# EAGLE schematic CD_CONTROL_BRD (EAGLE 7.2.0)
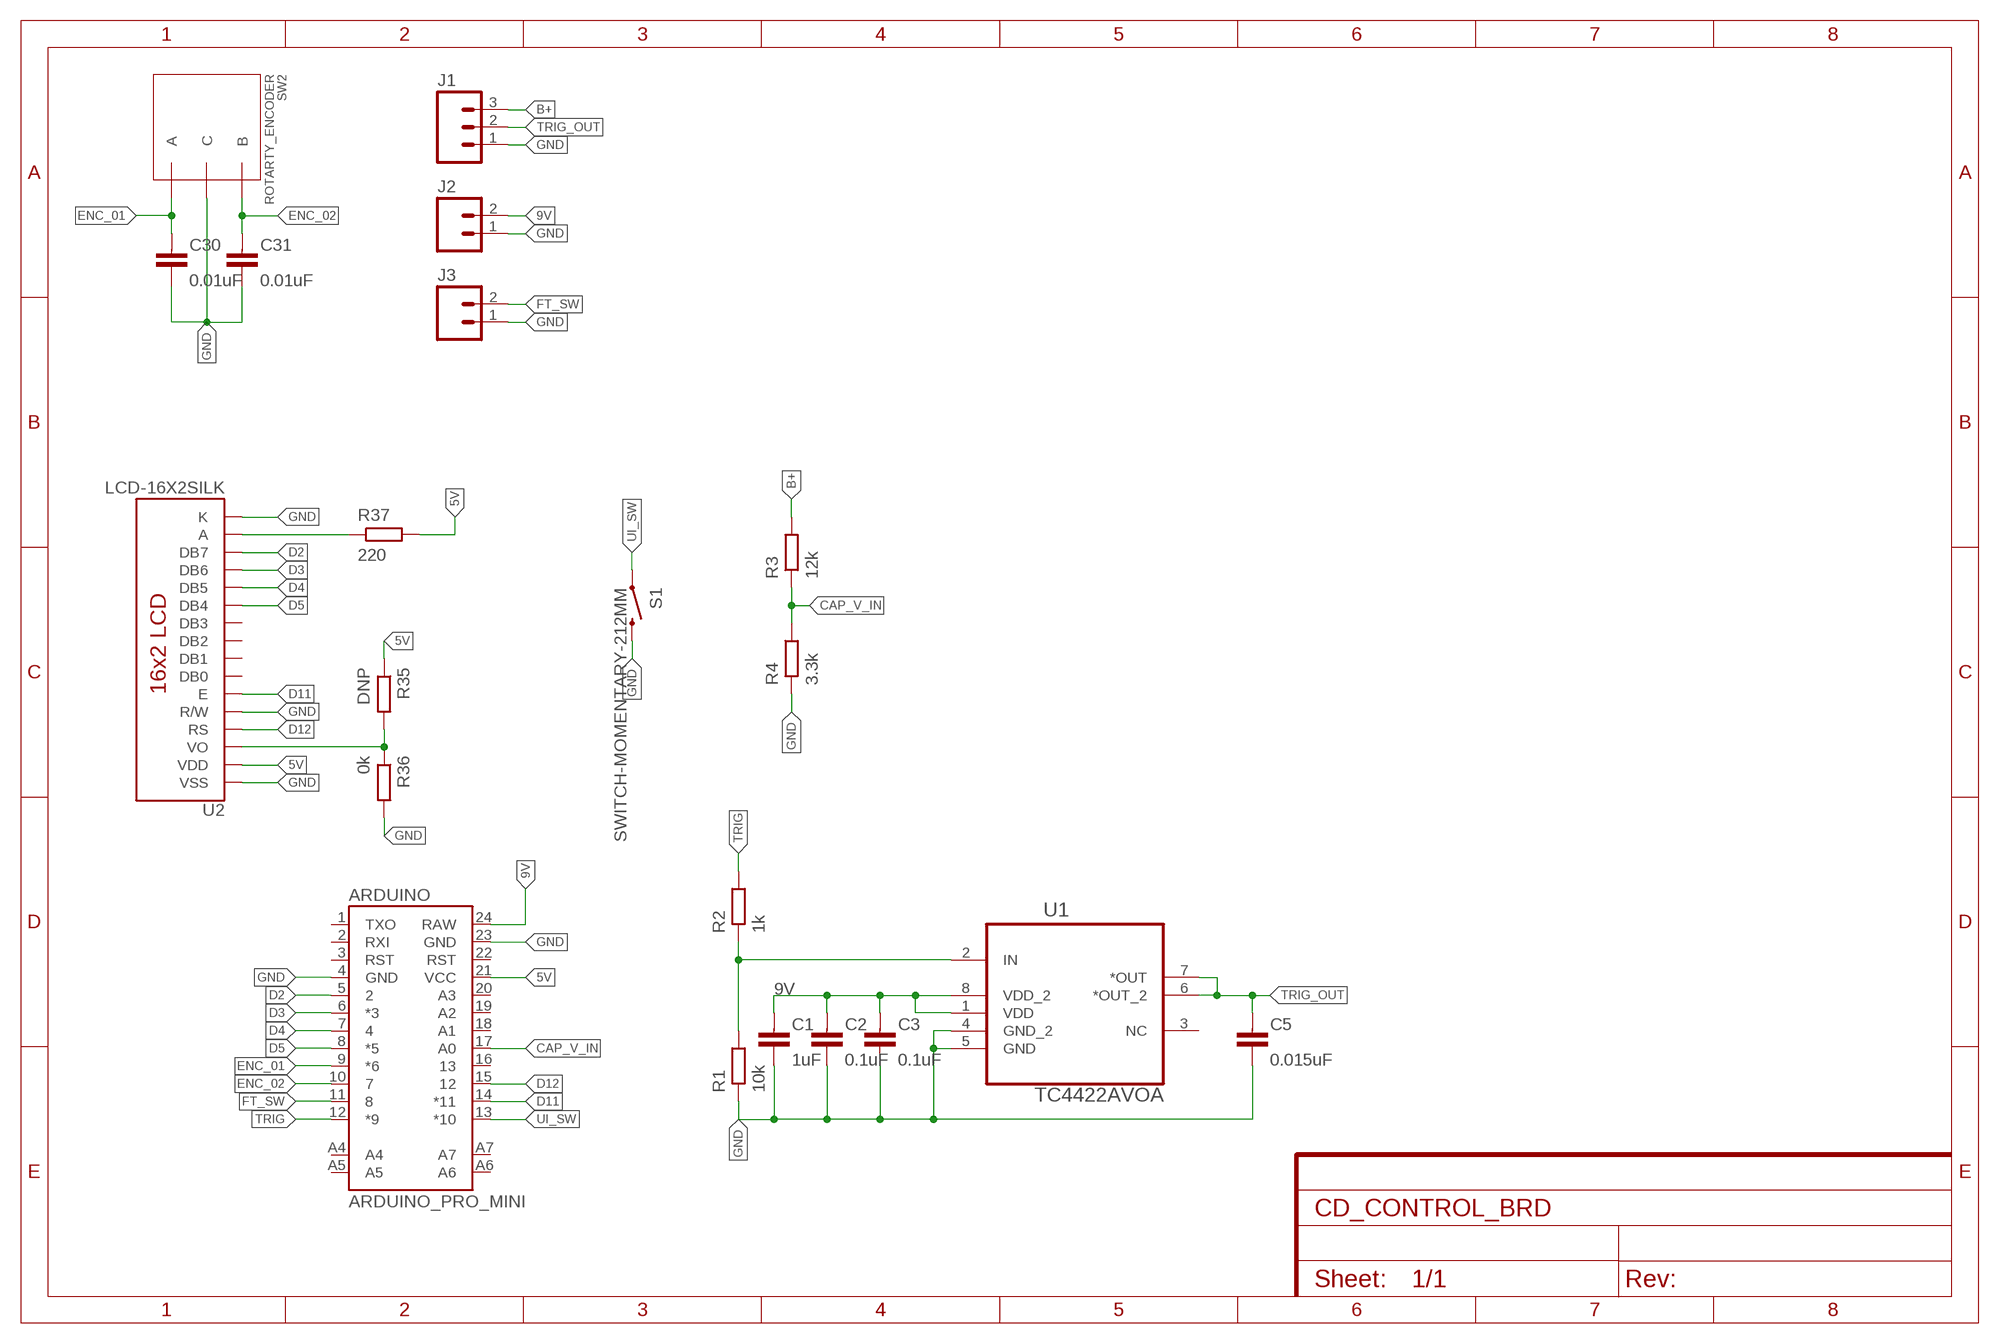
[diagram p0: schematic, sheet 1]

## Parts
ARDUINO  ARDUINO_PRO_MINI  [ARDUINO_PRO_MINI]
C1  1uF  CAPACITOR0805-N  [C0805-N]
C2  0.1uF  CAPACITOR0603-N  [C0603-N]
C3  0.1uF  CAPACITOR0603-N  [C0603-N]
C5  0.015uF  CAPACITOR0603-N  [C0603-N]
C30  0.01uF  CAPACITOR0603-N  [C0603-N]
C31  0.01uF  CAPACITOR0603-N  [C0603-N]
J1  M03LOCK_NO_SILK  [1X03_LOCK_NO_SILK]
J2  M02LOCK  [1X02_LOCK]
J3  M02LOCK  [1X02_LOCK]
R1  10k  RESISTOR0603-N  [R0603-N]
R2  1k  RESISTOR0603-N  [R0603-N]
R3  12k  RESISTOR0603-N  [R0603-N]
R4  3.3k  RESISTOR0603-N  [R0603-N]
R35  DNP  RESISTOR0603-N  [R0603-N]
R36  0k  RESISTOR0603-N  [R0603-N]
R37  220  RESISTOR0603-N  [R0603-N]
S1  SWITCH-MOMENTARY-212MM  [TACTILE-PTH-12MM]
SW2  ROTARTY_ENCODER  [ROTARY_ENC_PLAIN]
U1  TC4422AVOA  [SOIC127P600X175-8N]
U2  LCD-16X2SILK  [LCD-16X2]

## Nets
5V: ARDUINO.21(VCC) R35.1 R37.2 U2.2(VDD)
9V: ARDUINO.24(RAW) C1.1 C2.1 C3.1 J2.2 U1.1(VDD) U1.8(VDD_2)
B+: J1.3 R3.2
CAP_V_IN: ARDUINO.17(A0) R3.1 R4.2
D2: ARDUINO.5 U2.14(DB7)
D3: ARDUINO.6(*3) U2.13(DB6)
D4: ARDUINO.7 U2.12(DB5)
D5: ARDUINO.8(*5) U2.11(DB4)
D11: ARDUINO.14(*11) U2.6(E)
D12: ARDUINO.15 U2.4(RS)
ENC_01: ARDUINO.9(*6) C30.1 SW2.A
ENC_02: ARDUINO.10 C31.1 SW2.B
FT_SW: ARDUINO.11 J3.2
GND: ARDUINO.4(GND) ARDUINO.23(GND) C1.2 C2.2 C3.2 C5.2 C30.2 C31.2 J1.1 J2.1 J3.1 R1.1 R4.1 R36.2 S1.3 SW2.C U1.4(GND_2) U1.5(GND) U2.1(VSS) U2.5(R/W) U2.16(K)
N$3: R1.2 R2.1 U1.2(IN)
N$17: R37.1 U2.15(A)
N$28: R35.2 R36.1 U2.3(VO)
TRIG: ARDUINO.12(*9) R2.2
TRIG_OUT: C5.1 J1.2 U1.6(*OUT_2) U1.7(*OUT)
UI_SW: ARDUINO.13(*10) S1.1
Unconnected: ARDUINO.1(TXO) ARDUINO.2(RXI) ARDUINO.3(RST) ARDUINO.16 ARDUINO.18(A1) ARDUINO.19(A2) ARDUINO.20(A3) ARDUINO.22(RST) ARDUINO.A4 ARDUINO.A5 ARDUINO.A6 ARDUINO.A7 U1.3(NC) U2.7(DB0) U2.8(DB1) U2.9(DB2) U2.10(DB3)

## Library data of the parts
ARDUINO = _my-parts:ARDUINO_PRO_MINI
C1-C3 C5 C30 C31 = passives-7351:CAPACITOR
J1 = SparkFun-Connectors:M03: Header 3 Standard 3-pin 0.1" header. Use with straight break away headers (SKU : PRT-00116), right angle break away headers (PRT-00553), swiss pins (PRT-00743), machine pins (PRT-00117), and female headers (PRT-00115). Molex polarized connector foot print use with SKU : PRT-08232 with associated crimp pins and housings.
J2 J3 = SparkFun-Connectors:M02: Standard 2-pin 0.1" header. Use with - straight break away headers ( PRT-00116) - right angle break away headers (PRT-00553) - swiss pins (PRT-00743) - machine pins (PRT-00117) - female headers (PRT-00115) Molex polarized connector foot print use with: PRT-08233 with associated crimp pins and housings. 2.54_SCREWTERM for use with PRT-10571. 3.5mm Screw Terminal footprints for PRT-08084 5mm Screw Terminal footprints for use with PRT-08432
R1-R4 R35-R37 = passives-7351:RESISTOR
S1 = SparkFun-Electromechanical:SWITCH-MOMENTARY-2: Various NO switches- pushbuttons, reed, etc; PROD_ID: SWCH-09185
SW2 = _my-parts:ROTARTY_ENCODER: Simple no LED rotary encoder Example: COM-09117
U1 = Microchip_By_element14_Batch_1:TC4422AVOA: DRIVER, MOSFET, SINGL 9A,; MPN: TC4422AVOA; OC_FARNELL: 1332306; OC_NEWARK: 22K2735; PACKAGE: 8 - SOIC; SUPPLIER: Microchip
U2 = SparkFun-Displays:LCD-16X2: Standard text-only 16x2 parallel input LCD